# EasyEDA Pro project 16V2_EDA.eprj

# Schematic Schematic2
Board Name: Board1; Create Date: 2024-11-21; Page Name: P1; Project Name: 16V2_EDA; Schematic Name: Schematic2; Update Date: 2024-11-22; Company: 嘉立创EDA; Page Size: A4; Version: V1.0
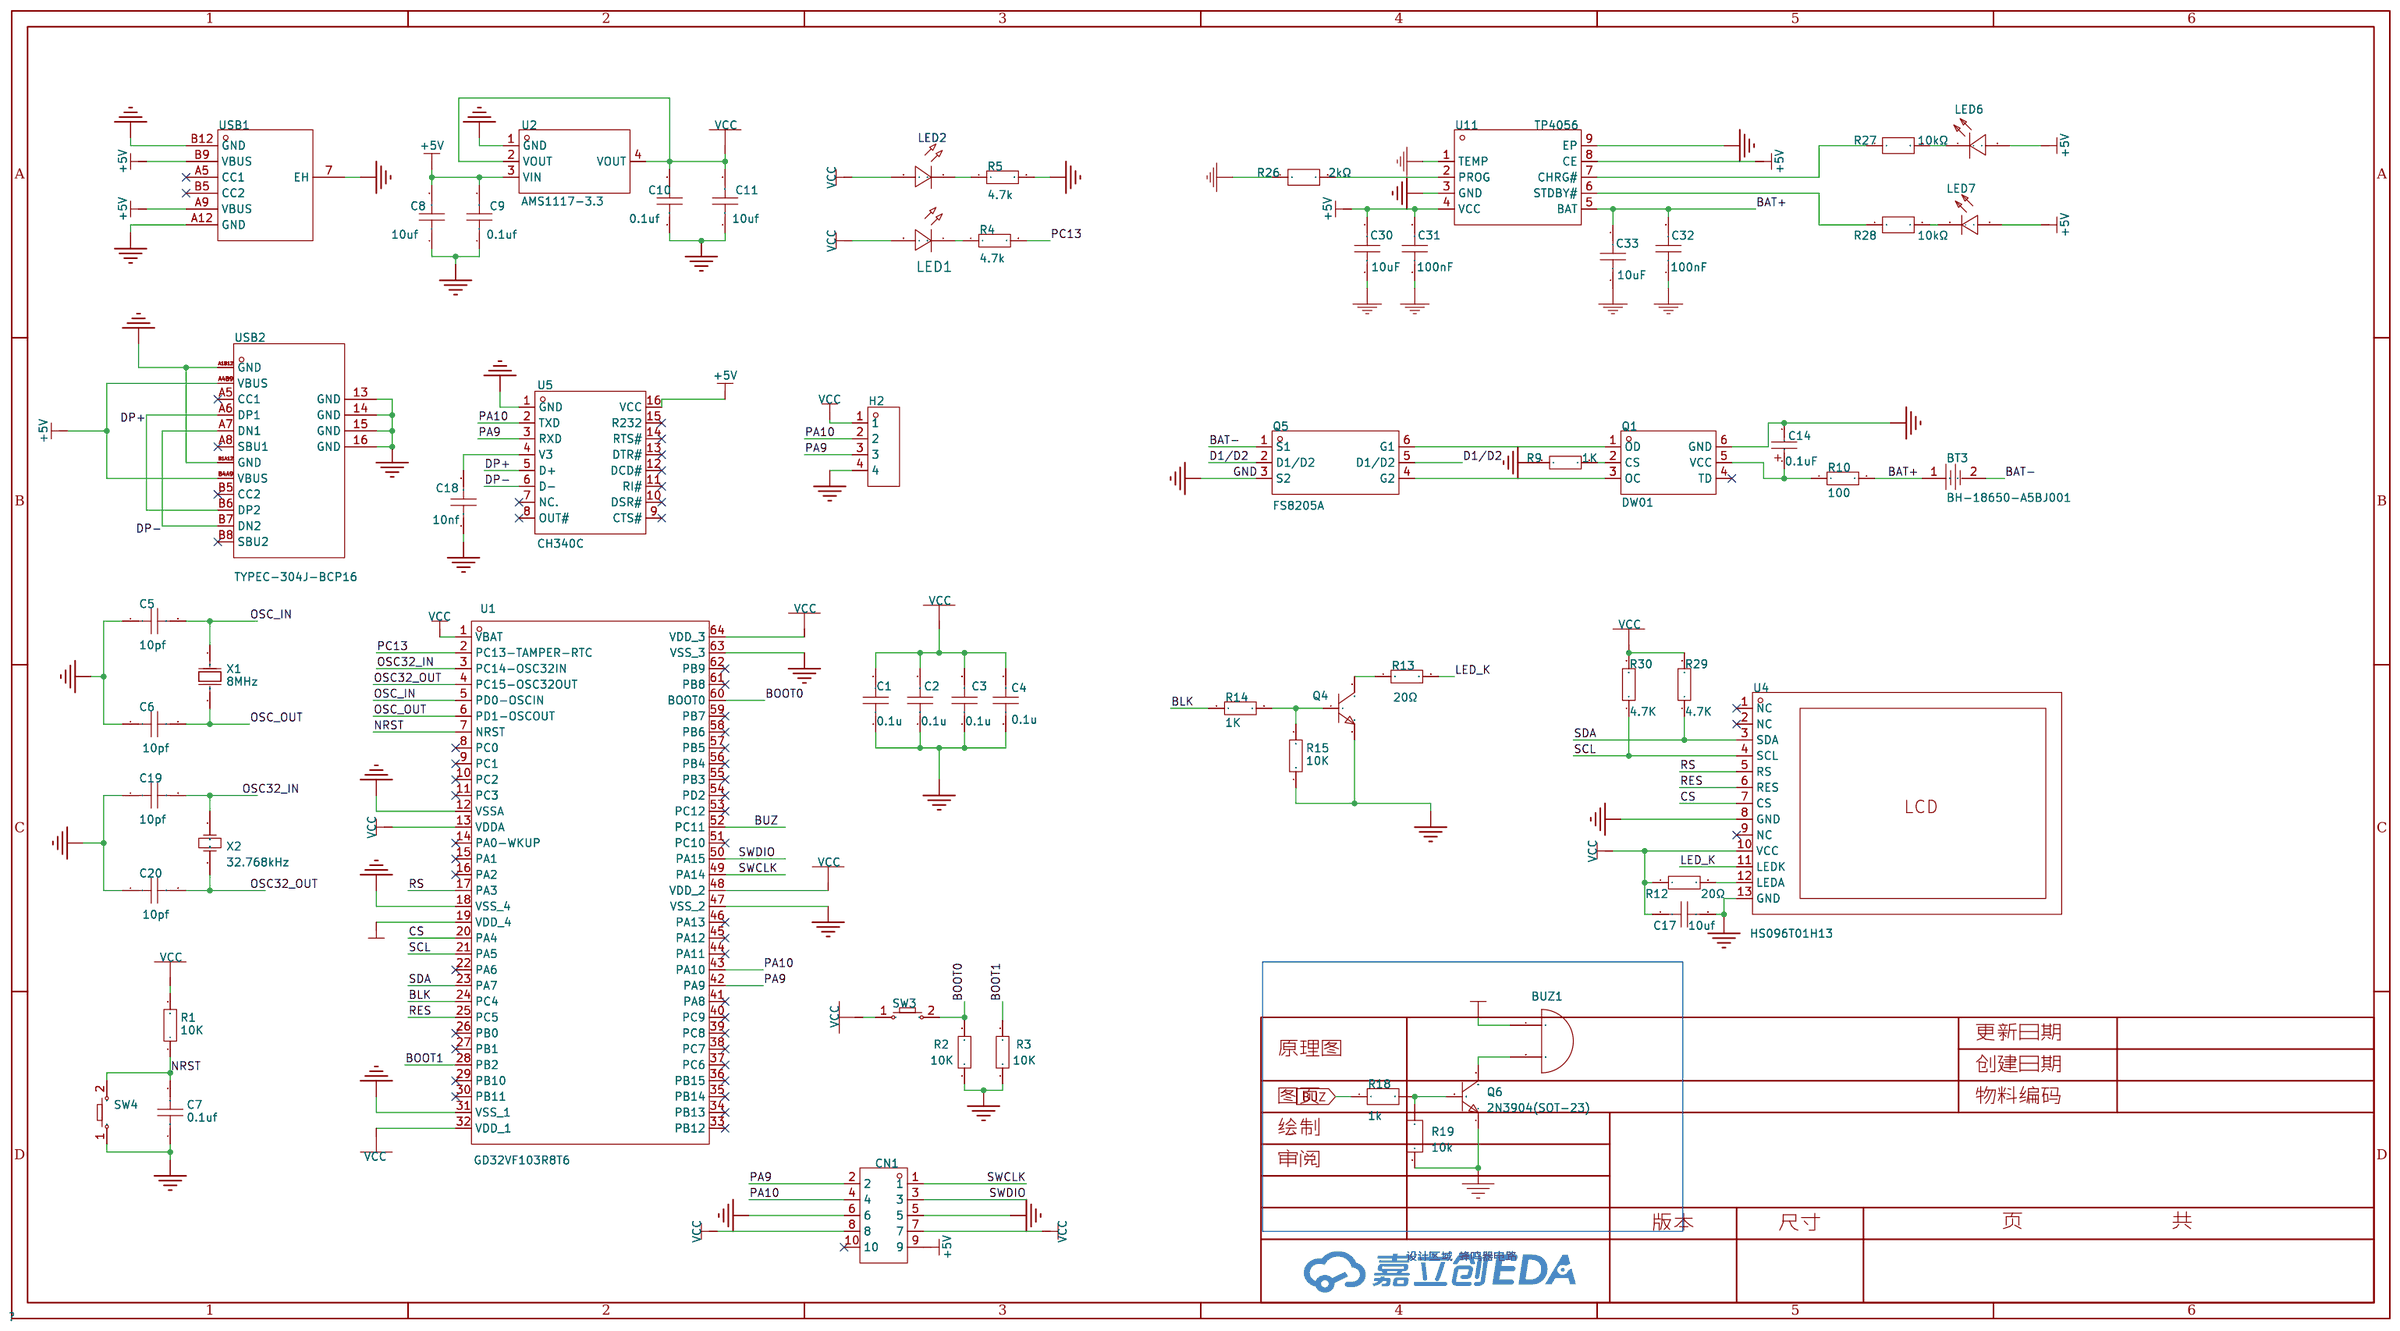
[diagram p0: schematic sheet]

## Parts
BT3  BH-18650-A5BJ001  [BAT-SMD_CR1220-2ZX]
BUZ1  BUZ1  [BUZ]
C1  0.1u  [C0603]
C2  0.1u  [C0603]
C3  0.1u  [C0603]
C4  0.1u  [C0603]
C5  10pf  [C0603]
C6  10pf  [C0603]
C7  0.1uf  [C0603]
C8  10uf  [C0603]
C9  0.1uf  [C0603]
C10  0.1uf  [C0603]
C11  10uf  [C0603]
C14  0.1uF  [C0603]
C17  10uf  [C0603]
C18  10nf  [C0603]
C19  10pf  [C0603]
C20  10pf  [C0603]
C30  10uF  [C0603]
C31  100nF  [C0603]
C32  100nF  [C0603]
C33  10uF  [C0603]
CN1  ZX-PZ2.54-2-5PZZ  [hdr-th_10p-p2.54-v-m-r2-c5-s2.54]
H2  2.54-1*4P反弯排针  [HDR-TH_4P-P2.54-H-M-W10.4]
LED1  -  [LED_0603]
LED2  -  [LED_0603]
LED6  KT-0603R  [LED0603-RD]
LED7  NCD0603B1  [LED0603-RD]
Q1  DW01  [SOT-23-6_L2.9-W1.6-P0.95-LS2.8-BR]
Q4  -  [S8050_SOT-23]
Q5  FS8205A  [SOT-23-6_L2.9-W1.6-P0.95-LS2.8-BR]
Q6  2N3904(SOT-23)  [sot-23-3_l2.9-w1.3-p1.90-ls2.4-br]
R1  10K  [R0603]
R2  10K  [R0603]
R3  10K  [R0603]
R4  4.7k  [R0603]
R5  4.7k  [R0603]
R9  1K  [R0603]
R10  100  [R0603]
R12  20Ω  [R0603]
R13  20Ω  [R0603]
R14  1K  [R0603]
R15  10K  [R0603]
R18  1k  [R0603]
R19  10k  [R0603]
R26  2kΩ  [R0603]
R27  10kΩ  [R0603]
R28  10kΩ  [R0603]
R29  4.7K  [R0603]
R30  4.7K  [R0603]
SW3  -  [Key_SMD_3x4x2]
SW4  -  [Key_SMD_3x4x2]
U1  GD32VF103R8T6  [LQFP-64_L10.0-W10.0-P0.50-LS12.0-BL]
U2  AMS1117-3.3  [SOT-223-3_L6.5-W3.4-P2.30-LS7.0-BR]
U4  HS096T01H13  [LCD-SMD_HS096T01H13]
U5  CH340C  [SOP-16_L10.0-W3.9-P1.27-LS6.0-BL]
U11  TP4056  [esop-8_l4.9-w3.9-p1.27-ls6.0-bl-ep]
USB1  TYPE-C 6P  [TYPE-C-SMD_TYPE-C-6P]
USB2  TYPEC-304J-BCP16  [USB-C-SMD_TYPEC-304J-BCP16]
X1  8MHz  [HC-49S_L10.8-W4.5-P4.88]
X2  32.768kHz  [CRYSTAL-SMD_L3.2-W1.5]

## Library data of the parts
BT3 = BH-18650-A5BJ001: BHNi DIP 适用电池18650电芯//电池底座/卧式DIP 电池盒/电池座 材质：PP  镀镍 ，; Supplier Part: C5383220; Manufacturer: MYOUNG(美阳); Supplier Footprint: 插件; Datasheet: https://atta.szlcsc.com/upload/public/pdf/source/20230321/F45C04DF2D4E00D187312CBE97BD9F67.pdf; Supplier: LCSC
BUZ1 = BUZ1
C1-C11 C17-C20 = CAP_0603: Supplier Footprint: 0603
C14 = C_Ele_SMD_3x5.4mm: Supplier Footprint: SMD,3x5.4mm
C30 C33 = CL21A106KAYNNNE_C15850: 容值:10uF;精度:±10%;额定电压:25V;材质(温度系数):X5R;; LCSC Part Name: 10uF ±10% 25V; Supplier Part: C15850; Manufacturer: SAMSUNG(三星); Manufacturer Part: CL21A106KAYNNNE; Supplier Footprint: 0805; JLCPCB Part Class: Basic Part; Datasheet: https://atta.szlcsc.com/upload/public/pdf/source/20160218/1457707763339.pdf; Supplier: LCSC; Tolerance: ±10%; Voltage Rated: 25V; Temperature Coefficient: X5R
C31 C32 = CC0603KRX7R9BB104: 容值:100nF;精度:±10%;额定电压:50V;材质(温度系数):X7R;; LCSC Part Name: 100nF ±10% 50V; Supplier Part: C14663; Manufacturer: YAGEO(国巨); Supplier Footprint: 0603; JLCPCB Part Class: 基础库; Datasheet: https://atta.szlcsc.com/upload/public/pdf/source/20180910/C282072_33301C7F631E79921B82A8DAC6BCC5B3.pdf; Supplier: LCSC; Tolerance: ±10%; Voltage Rated: 50V; Temperature Coefficient: X7R
CN1 = ZX-PZ2.54-2-5PZZ: 插针结构:2x5P;间距:2.54mm;行距:2.54mm;圆针/方针:方针;安装类型:直插;排数:双排;总PIN位数:10P;额定电流:3A;额定电压:1kV;配合针长度:6mm;塑高:2.5mm;端接针长度:3mm;触头材质:黄铜;触头镀层:金;工作温度范围:-40℃~+105℃;焊接温度(最大值):-;颜色:黑色;; LCSC Part Name: 2x5P 间距:2.54mm 方针 直插; Supplier Part: C7501276; Manufacturer: Megastar(兆星); Supplier Footprint: 插件,P=2.54mm; JLCPCB Part Class: Extended Part; Datasheet: https://atta.szlcsc.com/upload/public/pdf/source/20231122/7DD2FA5A7FDBC10CDDB6051CB6BC6AD1.pdf; Supplier: LCSC; Pin Structure: 2x5P; Pitch: 2.54mm; Row Spacing: 2.54mm; Circluar Pins/Square Pins: 方针; Mounting Type: 直插; Number of Rows: 双排; Number of Pins: 10P; Current Rating (Max): 3A; Voltage Rating (Max): 1kV; Length of Mating Pin: 6mm; Insulation Height: 2.5mm; Length of End Connection Pin: 3mm; Contact Material: 黄铜; Contact Plating: 金; Operating Temperature Range: -40℃~+105℃; Color: 黑色; Check: false
H2 = 2.54-1*4P反弯排针: 插针结构:1x4P;间距:2.54mm;行距:-;圆针/方针:方针;安装类型:弯插;排数:单排;总PIN位数:4P;额定电流:3A;额定电压:-;配合针长度:6mm;塑高:-;端接针长度:-;触头材质:-;触头镀层:-;工作温度范围:-55℃~+105℃;颜色:黑色;; LCSC Part Name: 间距:2.54mm 1x4P 弯插 方针; Supplier Part: C91552; Manufacturer: BOOMELE(博穆精密); Supplier Footprint: 弯插,P=2.54mm; JLCPCB Part Class: 扩展库; Datasheet: https://atta.szlcsc.com/upload/public/pdf/source/20190508/C74252_03DDEC4696EE17172E44B96636392962.pdf; Supplier: LCSC; Pin Structure: 1x4P; Pitch: 2.54mm; Circluar Pins/Square Pins: 方针; Mounting Type: 弯插; Number of Rows: 单排; Number of Pins: 4P; Current Rating (Max): 3A; Length of Mating Pin: 6mm; Operating Temperature Range: -55℃~+105℃; Color: 黑色
LED1 = LED_0603-R: Supplier Footprint: 0603
LED2 = LED_0603-G: Supplier Footprint: 0603
LED6 = KT-0603R: Supplier: LCSC; Manufacturer: KENTO; Supplier Part: C2286; JLCPCB Part Class: Basic Part
LED7 = NCD0603B1: 发光颜色:蓝色;正向电压(VF):2.6V~3.6V;功率:72mW;正向电流:10mA;主波长:463nm~475nm;透镜颜色:无色透明透镜;发光强度:80mcd~220mcd;发光角度:130°;工作温度:-30℃~+85℃;; Supplier Part: C84266; Manufacturer: 国星光电; Supplier Footprint: 0603; JLCPCB Part Class: Extended Part; Datasheet: https://atta.szlcsc.com/upload/public/pdf/source/20200820/C84266_6A3CDBEFA72C6CAD68EDA53474ADAE6C.pdf; Supplier: LCSC; Emitted Color: 蓝色; Forward Voltage (VF): 2.6V~3.6V; Power Dissipation: 72mW; Forward Current: 10mA; Dominant Wavelength: 463nm~475nm; Lens Color: 无色透明透镜; Luminous Intensity: 80mcd~220mcd; Viewing Angle: 130°; Operating Temperature: -30℃~+85℃
Q1 = DW01_C181096: Supplier Part: C181096; Manufacturer: Hottech(合科泰); Supplier Footprint: SOT-23-6; Datasheet: https://atta.szlcsc.com/upload/public/pdf/source/20231007/94AC323C2B651AEA18C7FC8F0156E5A9.pdf; Supplier: LCSC
Q4 = S8050_SOT_NPN: Supplier Footprint: SOT-23
Q5 = FS8205A: 类型:2个N沟道;漏源电压(Vdss):20V;连续漏极电流(Id):6A;功率(Pd):1.5W;导通电阻(RDS(on)@Vgs,Id):19.5mΩ@4.5V,3A;阈值电压(Vgs(th)@Id):700mV@250uA;; LCSC Part Name: 2个N沟道 耐压:20V 电流:6A; Supplier Part: C2830320; Manufacturer: TECH PUBLIC(台舟); Supplier Footprint: SOT-23-6; JLCPCB Part Class: 扩展库; Datasheet: https://atta.szlcsc.com/upload/public/pdf/source/20210810/F53B6D4E8755A1F8E11BAF814CE98E6A.pdf; Supplier: LCSC; Type: 2个N沟道; Drain Source Voltage (Vdss): 20V; Continuous Drain Current (Id): 6A; Power Dissipation (Pd): 1.5W; Drain Source On Resistance (RDS(on)@Vgs,Id): 19.5mΩ@4.5V,3A; Gate Threshold Voltage (Vgs(th)@Id): 700mV@250uA; Total Gate Charge (Qg@Vgs): 5.7nC@10V; Input Capacitance (Ciss@Vds): 466pF@10V; Reverse Transfer Capacitance (Crss@Vds): 58pF@10V; Operating Temperature: -55℃~+150℃@(Tj)
Q6 = 2n3904S-RTK/PS: Supplier: LCSC; Manufacturer: KEC; Supplier Part: C18536; Paste Type: SOT-23
R1-R5 R9 R10 R12-R15 R29 R30 = Res_0603: Supplier Footprint: 0603
R18 = 1k
R19 = 10k
R26 = 0603WAF2001T5E: 电阻类型:厚膜电阻;阻值:2kΩ;精度:±1%;功率:100mW;最大工作电压:75V;温度系数:±100ppm/℃;; LCSC Part Name: 2kΩ ±1% 100mW 厚膜电阻; Supplier Part: C22975; Manufacturer: UNI-ROYAL(厚声); Supplier Footprint: 0603; JLCPCB Part Class: Basic Part; Datasheet: https://atta.szlcsc.com/upload/public/pdf/source/20200306/C422600_1E6D84923E4A46A82E41ADD87F860B5C.pdf; Supplier: LCSC; Type: 厚膜电阻; Tolerance: ±1%; Power(Watts): 100mW; Overload Voltage (Max): 75V; Temperature Coefficient: ±100ppm/℃; Operating Temperature Range: -55℃~+155℃
R27 R28 = 0603WAF1002T5E: 电阻类型:厚膜电阻;阻值:10kΩ;精度:±1%;功率:100mW;最大工作电压:75V;温度系数:±100ppm/℃;; LCSC Part Name: 厚膜电阻 10kΩ ±1% 100mW; Supplier Part: C25804; Manufacturer: UNI-ROYAL(厚声); Supplier Footprint: 0603; JLCPCB Part Class: Basic Part; Datasheet: https://atta.szlcsc.com/upload/public/pdf/source/20200306/C422600_1E6D84923E4A46A82E41ADD87F860B5C.pdf; Supplier: LCSC; Type: 厚膜电阻; Tolerance: ±1%; Power(Watts): 100mW; Overload Voltage (Max): 75V; Temperature Coefficient: ±100ppm/℃; Operating Temperature Range: -55℃~+155℃
SW3 SW4 = Key_SMD_3x4x2: Supplier Footprint: SMD
U1 = GD32VF103R8T6: CPU内核:RISC-V;程序存储容量:64KB;RAM总容量:20KB;GPIO端口数量:51;工作电压范围:-;CPU最大主频:108MHz;程序存储器类型:FLASH;; Supplier Part: C5178402; Manufacturer: GigaDevice(兆易创新); Supplier Footprint: LQFP-64(10x10); Supplier: LCSC; CPU Core: RISC-V; Program Storage Size: 64KB; RAM Size: 20KB; GPIO Ports Number: 51; CPU Maximum Speed: 108MHz; Program Memory Type: FLASH; ADC (Bit): 12bit; DAC (Bit): 12bit; 16Bit Timer: 7; CAN: 2; UART/USART: 5; I2C: 2; I2S: 2; SPI: 3; Universal Serial Bus: 有; Peripheral/Function: 看门狗；RTC实时时钟; Watchdog: 有; Real-Time Clock: 有
U2 = AMS1117-3.3_C6186: 输出类型:固定;最大输入电压:-;输出电压:3.3V;最大输出电流:1A;电源纹波抑制比(PSRR):72dB@(120Hz);输出极性:正极;; LCSC Part Name: 输出3.3V 1A; Supplier Part: C6186; Manufacturer: AMS; Supplier Footprint: SOT-223; JLCPCB Part Class: 基础库; Datasheet: https://atta.szlcsc.com/upload/public/pdf/source/20180727/C6186_7A095716F0823C02F1997A905E26C086.pdf; Supplier: LCSC; Output Type: 固定; Output Voltage: 3.3V; MAX Output Current: 1A; Power Supply Rejection Ratio (PSRR): 72dB@(120Hz); Dropout Voltage: 1.3V@(800mA); Output Polarity: 正极; Number of Outputs: 1
U4 = HS096T01H13: 主控芯片:ST7735;尺寸(inch):0.96;; LCSC Part Name: 0.96寸 0.96寸800x160(RGB)彩色SPI串口TFT液晶显示屏; Supplier Part: C18198246; Manufacturer: HS(汉昇); Datasheet: https://atta.szlcsc.com/upload/public/pdf/source/20230921/67AD52EDFD5E8BFFA1AE424F3A3F761A.pdf; Supplier: LCSC; Main Control Chip: ST7735; Size: 0.96; Operating Temperature: -20℃~+70℃
U5 = CH340C: 应用功能:收发器;接口协议:USB 2.0;数据速率:2Mbps;; LCSC Part Name: CH340C USB转串口芯片 CH340; Supplier Part: C84681; Manufacturer: WCH(南京沁恒); Supplier Footprint: SOP-16; JLCPCB Part Class: 扩展库; Datasheet: https://atta.szlcsc.com/upload/public/pdf/source/20200819/C84681_ADBED554CE321879DBD6B1D06488689C.pdf; Supplier: LCSC; Applications Function: 收发器; Protocol: USB 2.0; Supply Voltage: 3.3V；5V; Data Rate: 2Mbps
U11 = TP4056_C725790: Supplier: LCSC; Supplier Part: C725790; Manufacturer: UMW(友台半导体); JLCPCB Part Class: Extended Part
USB1 = TYPE-C 6P: 连接器类型:Type-C;标准:-;公母:母;端口数量:1;触点数量:6P;安装方式:卧贴;额定电流 - 电源:-;工作温度范围:-40℃~+85℃;; LCSC Part Name: Type-C 母 卧贴; Supplier Part: C456012; Manufacturer: SHOU HAN(首韩); Supplier Footprint: SMD; JLCPCB Part Class: 扩展库; Datasheet: https://atta.szlcsc.com/upload/public/pdf/source/20201203/C456012_B13F72044DF846EDBE9BDD0D1D3CD166.pdf; Supplier: LCSC; Connector Type: Type-C; Gender: 母; Number of Ports: 1; Number of Contacts: 6P; Mounting Style: 卧贴; Operating Temperature Range: -40℃~+85℃
USB2 = TYPEC-304J-BCP16: 连接器类型:Type-C;标准:USB 3.1;公母:母;端口数量:1;触点数量:16P;安装方式:卧贴;额定电流 - 电源:5A;工作温度范围:-40℃~+85℃;焊接温度(最大值):260℃;; LCSC Part Name: Type-C 母 卧贴; Supplier Part: C2835315; Manufacturer: XUNPU(讯普); Supplier Footprint: SMD; Datasheet: https://atta.szlcsc.com/upload/public/pdf/source/20210528/C2835315_A76BD3CF9329D12B6041421AD23BFD66.pdf; Supplier: LCSC; Connector Type: Type-C; Standard: USB 3.1; Gender: 母; Number of Ports: 1; Number of Contacts: 16P; Mounting Style: 卧贴; Current Rating - Power (Max): 5A; Operating Temperature Range: -40℃~+85℃; Soldering Temperature(Max): 260℃
X1 = X49SM8MSD2SC: 晶振类型:贴片晶振;频率:8MHz;常温频差:±20ppm;外接负载电容:20pF;频率稳定度(全温):±30ppm;; LCSC Part Name: 8MHz ±20ppm 20pF; Supplier Part: C12674; Manufacturer: YXC(扬兴晶振); Supplier Footprint: HC-49S-SMD; JLCPCB Part Class: 基础库; Datasheet: https://atta.szlcsc.com/upload/public/pdf/source/20240329/3EBF42EBCAB50CA65B6FA9D7CFA1955A.pdf; Supplier: LCSC; Crystal Type: 贴片晶振; Normal temperature Frequency Tolerance: ±20ppm; External load capacitor: 20pF; Frequency Stability(Full temperature range): ±30ppm; Operating Temperature: -20℃~+70℃
X2 = X308032768KGB2SC: 晶振类型:直插晶振;频率:32.768kHz;常温频差:±10ppm;外接负载电容:12.5pF;频率稳定度(全温):-;; LCSC Part Name: 32.768kHz ±10ppm 12.5pF YT-38; Supplier Part: C52082; Manufacturer: YXC(扬兴晶振); Supplier Footprint: DT-38; JLCPCB Part Class: Extended Part; Datasheet: https://atta.szlcsc.com/upload/public/pdf/source/20240329/231E1A1EB7C875CD193DBE6664A3DE3A.pdf; Supplier: LCSC; Crystal Type: 直插晶振; Normal temperature Frequency Tolerance: ±10ppm; External load capacitor: 12.5pF; Operating Temperature: -20℃~+70℃

## Nets
+5V: C8.2 C9.2 C30.2 C31.2 CN1.9 LED6.2(A) LED7.2(+) U2.3(VIN) U5.16(VCC) U11.4(VCC) U11.8(CE) USB1.A9(VBUS) USB1.B9(VBUS) USB2.A4B9(VBUS) USB2.B4A9(VBUS)
GND: C1.1 C2.1 C3.1 C4.1 C5.1 C6.1 C7.1 C8.1 C9.1 C10.1 C11.1 C14.2 C17.2 C18.1 C19.1 C20.1 C30.1 C31.1 C32.1 C33.1 CN1.5 CN1.6 H2.4 Q1.6(GND) Q4.2 Q5.3(S2) Q6.1(E) R2.1 R3.1 R5.2 R9.1 R15.1 R19.1 R26.1 SW4.1 U1.12(VSSA) U1.18(VSS_4) U1.31(VSS_1) U1.47(VSS_2) U1.63(VSS_3) U2.1(GND) U4.8(GND) U4.13(GND) U5.1(GND) U11.1(TEMP) U11.3(GND) U11.9(EP) USB1.7(EH) USB1.A12(GND) USB1.B12(GND) USB2.13(GND) USB2.14(GND) USB2.15(GND) USB2.16(GND) USB2.A1B12(GND) USB2.B1A12(GND)
VCC: BUZ1.1(A) C1.2 C2.2 C3.2 C4.2 C10.2 C11.2 C17.1 CN1.7 CN1.8 H2.1 LED1.2(A) LED2.2(A) R1.2 R12.1 R29.2 R30.2 SW3.1 U1.1(VBAT) U1.13(VDDA) U1.19(VDD_4) U1.32(VDD_1) U1.48(VDD_2) U1.64(VDD_3) U2.2(VOUT) U2.4(VOUT) U4.10(VCC)
BAT+: BT3.1 C32.2 C33.2 R10.2 U11.5(BAT)
BAT-: BT3.2 Q5.1(S1)
BLK: R14.1 U1.24(PC4)
BOOT0: R2.2 SW3.2 U1.60(BOOT0)
BOOT1: R3.2 U1.28(PB2)
BUZ: R18.1 U1.52(PC11)
CS: U1.20(PA4) U4.7(CS)
D1/D2: Q5.2(D1/D2) Q5.5(D1/D2)
DP+: U5.5(D+) USB2.A6(DP1) USB2.B6(DP2)
DP-: U5.6(D-) USB2.A7(DN1) USB2.B7(DN2)
LED_K: R13.2 U4.11(LEDK)
NRST: C7.2 R1.1 SW4.2 U1.7(NRST)
OSC32_IN: C19.2 U1.3(PC14-OSC32IN) X2.1(OSC1)
OSC32_OUT: C20.2 U1.4(PC15-OSC32OUT) X2.2(OSC2)
OSC_IN: C5.2 U1.5(PD0-OSCIN) X1.1(OSC1)
OSC_OUT: C6.2 U1.6(PD1-OSCOUT) X1.2(OSC2)
PA9: CN1.2 H2.3 U1.42(PA9) U5.3(RXD)
PA10: CN1.4 H2.2 U1.43(PA10) U5.2(TXD)
PC13: R4.2 U1.2(PC13-TAMPER-RTC)
RES: U1.25(PC5) U4.6(RES)
RS: U1.17(PA3) U4.5(RS)
SCL: R30.1 U1.21(PA5) U4.4(SCL)
SDA: R29.1 U1.23(PA7) U4.3(SDA)
SWCLK: CN1.1 U1.49(PA14)
SWDIO: CN1.3 U1.50(PA15)
$1N3244: LED1.1(C) R4.1
$1N3260: LED2.1(C) R5.1
$1N3280: Q1.2(CS) R9.2
$1N3281: C14.1 Q1.5(VCC) R10.1
$1N3299: R12.2 U4.12(LEDA)
$1N3320: Q4.3 R13.1
$1N3321: Q4.1 R14.2 R15.2
$1N3342: C18.2 U5.4(V3)
$1N3364: R26.2 U11.2(PROG)
$1N3367: R27.1 U11.7(CHRG#)
$1N3368: LED6.1(K) R27.2
$1N3369: LED7.1(-) R28.2
$1N3370: R28.1 U11.6(STDBY#)
$1N3387: Q1.1(OD) Q5.6(G1)
$1N3388: Q1.3(OC) Q5.4(G2)
$1N22505: Q6.2(B) R18.2 R19.2
$1N22563: BUZ1.2(B) Q6.3(C)

Not connected (* = marked no-connect by the designer): CN1 10*; Q1 4(TD)*; U1 8(PC0)* 9(PC1)* 10(PC2)* 11(PC3)* 14(PA0-WKUP)* 15(PA1)* 16(PA2)* 22(PA6)* 26(PB0)* 27(PB1)* 29(PB10)* 30(PB11)* 33(PB12)* 34(PB13)* 35(PB14)* 36(PB15)* 37(PC6)* 38(PC7)* 39(PC8)* 40(PC9)* 41(PA8)* 44(PA11)* 45(PA12)* 46(PA13)* 51(PC10)* 53(PC12)* 54(PD2)* 55(PB3)* 56(PB4)* 57(PB5)* 58(PB6)* 59(PB7)* 61(PB8)* 62(PB9)*; U4 1(NC)* 2(NC)* 9(NC)*; U5 7(NC.)* 8(OUT#)* 9(CTS#)* 10(DSR#)* 11(RI#)* 12(DCD#)* 13(DTR#)* 14(RTS#)* 15(R232)*; USB1 A5(CC1)* B5(CC2)*; USB2 A5(CC1)* A8(SBU1)* B5(CC2)* B8(SBU2)*

## Notes on the sheet
- 设计区域 蜂鸣器电路

# Board PCB
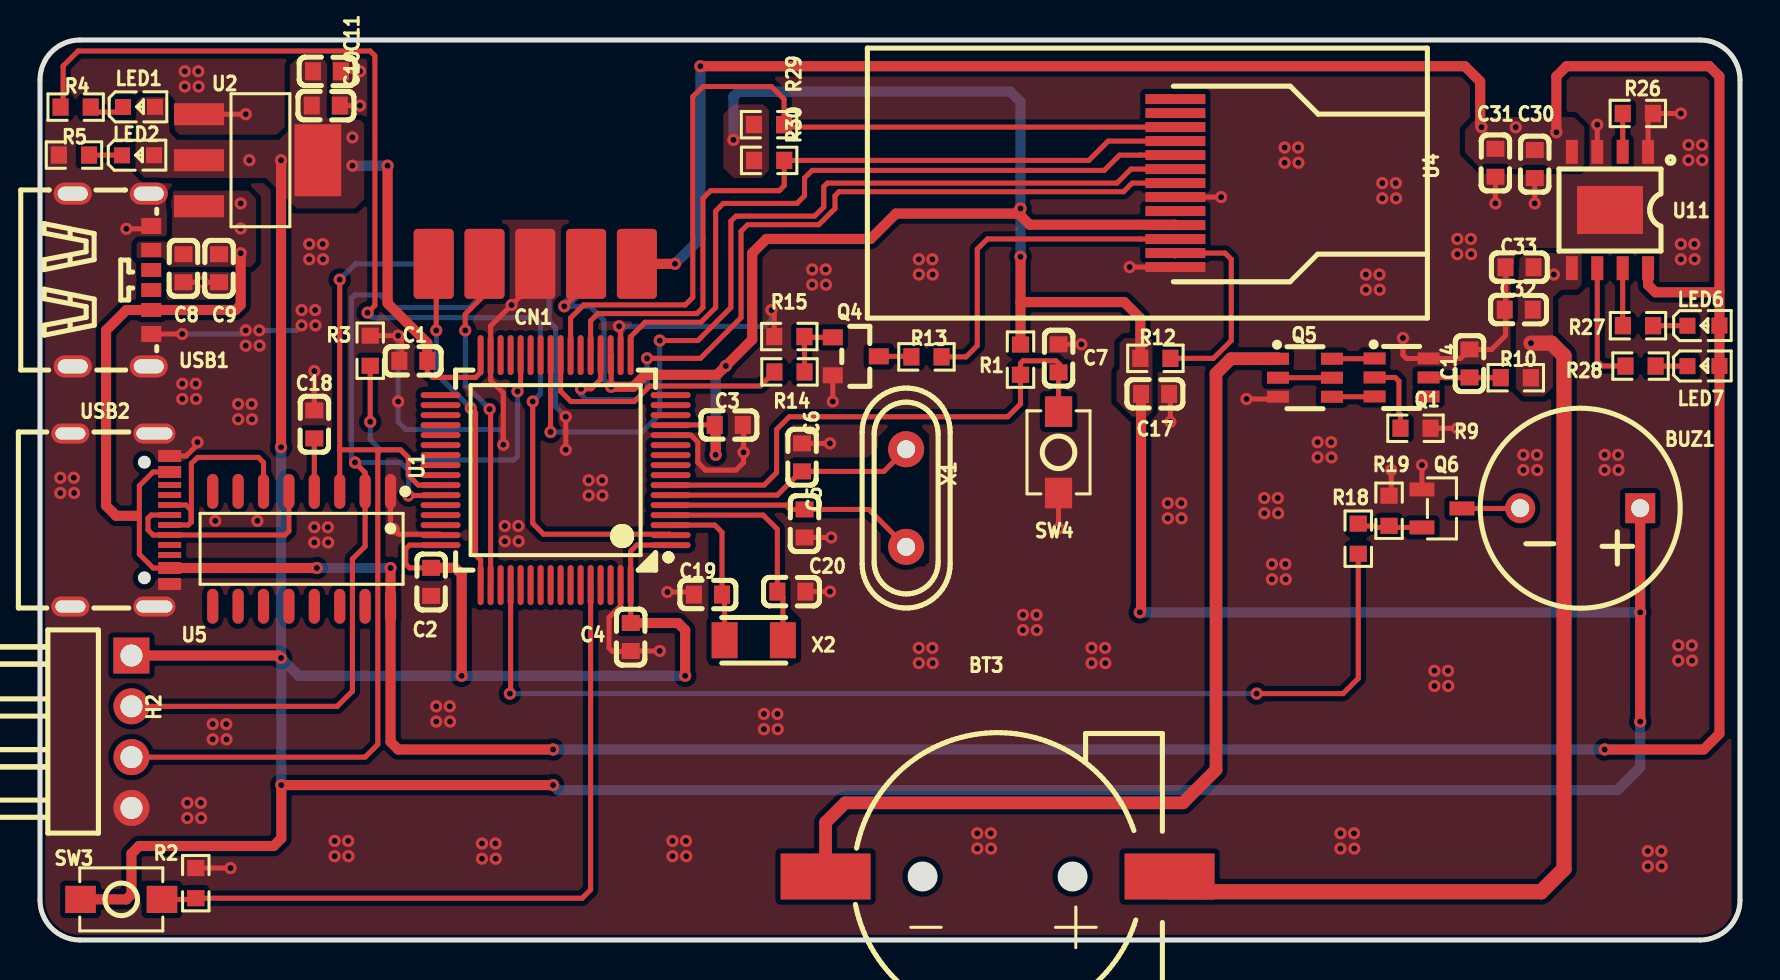
[diagram p1: board, top side]
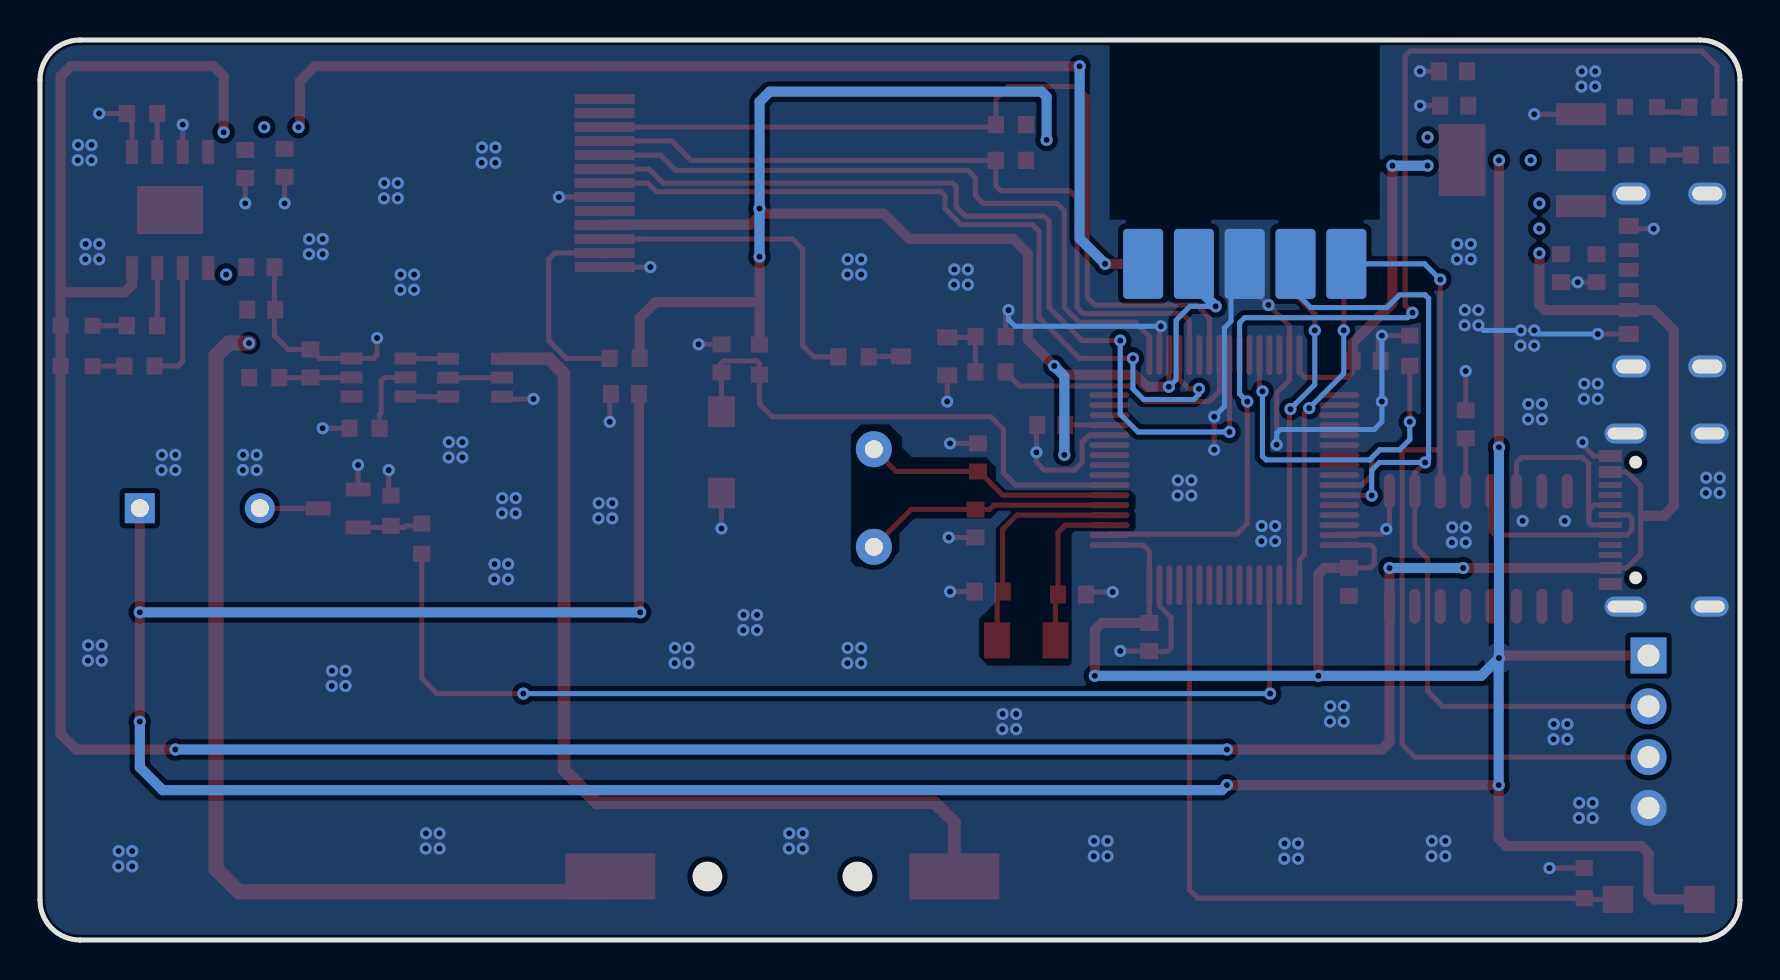
[diagram p2: board, bottom side, seen from below]

Outline 85 x 45 mm; copper layers: Top Layer, Inner1, Inner2, Inner3, Inner4, Inner5, Inner6, Inner7, Inner8, Inner9, Inner10, Inner11, Inner12, Inner13, Inner14, Inner15, Inner16, Inner17, Inner18, Inner19, Inner20, Inner21, Inner22, Inner23, Inner24, Inner25, Inner26, Inner27, Inner28, Inner29, Inner30, Bottom Layer. Coordinates in mm from the lower left corner of the outline.
Outline path: 0,43 0,2 arc(0.59,0.59) 2,0 83,0 arc(84.41,0.59) 85,2 85,43 arc(84.41,44.41) 83,45 2,45 arc(0.59,44.41) 0,43
Stack: Top Layer 0.035mm / Dielectric1 1.51mm FR4 er 4.5 / Bottom Layer 0.035mm

## Design rules (mm)
net DP+: DP1
net DP-: DP1
template: 自定义配置
spacing copperThickness1oz (default): track to track 0.178, other pairs 0.152 to 0.203
spacing copperThickness2oz: track to track 0.203, other pairs 0.152 to 0.3
track width copperThickness1oz (default): min 0.254, default 0.254, max 2.54
track width copperThickness2oz: min 0.203, default 0.254, max 2.54
differential pair differentialPair (default): width min 0.127, default 0.254, max 2.54; gap min 0.152, default 0.152
via viaSize (default): diameter min 0.61, default 0.61, max 0.61; hole min 0.305, default 0.305, max 0.305

## Placement (name value [footprint] x y rotation side)
BT3  BH-18650-A5BJ001  [BAT-SMD_CR1220-2ZX]  47.88 3.17 180 top
BUZ1  BUZ1  [BUZ]  80.01 21.59 180 top
C1  0.1u  [C0603]  18.67 28.96 0 top
C2  0.1u  [C0603]  19.56 17.91 90 top
C3  0.1u  [C0603]  34.44 25.75 180 top
C4  0.1u  [C0603]  29.54 15.15 90 top
C5  10pf  [C0603]  38.23 20.83 90 top
C6  10pf  [C0603]  38.1 24.13 270 top
C7  0.1uf  [C0603]  50.93 29.08 270 top
C8  10uf  [C0603]  7.17 33.59 90 top
C9  0.1uf  [C0603]  8.95 33.59 90 top
C10  0.1uf  [C0603]  14.29 41.72 180 top
C11  10uf  [C0603]  14.35 43.43 180 top
C14  0.1uF  [C0603]  71.48 28.83 90 top
C17  10uf  [C0603]  55.75 27.31 0 top
C18  10nf  [C0603]  13.72 25.78 270 top
C19  10pf  [C0603]  33.4 17.27 0 top
C20  10pf  [C0603]  37.57 17.42 180 top
C30  10uF  [C0603]  74.74 38.8 90 top
C31  100nF  [C0603]  72.77 38.86 90 top
C32  100nF  [C0603]  73.94 31.52 0 top
C33  10uF  [C0603]  73.98 33.64 0 top
CN1  ZX-PZ2.54-2-5PZZ  [hdr-th_10p-p2.54-v-m-r2-c5-s2.54]  24.76 40.64 180 top
H2  2.54-1*4P反弯排针  [HDR-TH_4P-P2.54-H-M-W10.4]  4.57 10.41 270 top
LED1  -  [LED_0603]  5 41.66 0 top
LED2  -  [LED_0603]  4.95 39.24 0 top
LED6  KT-0603R  [LED0603-RD]  83.17 30.72 0 top
LED7  NCD0603B1  [LED0603-RD]  83.17 28.7 0 top
Q1  DW01  [SOT-23-6_L2.9-W1.6-P0.95-LS2.8-BR]  68.08 28.13 180 top
Q4  -  [S8050_SOT-23]  40.79 29.31 180 top
Q5  FS8205A  [SOT-23-6_L2.9-W1.6-P0.95-LS2.8-BR]  63.25 28.11 180 top
Q6  2N3904(SOT-23)  [sot-23-3_l2.9-w1.3-p1.90-ls2.4-br]  70.1 21.58 180 top
R1  10K  [R0603]  49.03 29.02 90 top
R2  10K  [R0603]  7.79 2.84 270 top
R3  10K  [R0603]  16.51 29.46 270 top
R4  4.7k  [R0603]  1.78 41.64 180 top
R5  4.7k  [R0603]  1.7 39.25 180 top
R9  1K  [R0603]  68.78 25.59 180 top
R10  100  [R0603]  73.79 28.11 0 top
R12  20Ω  [R0603]  55.77 29.08 0 top
R13  20Ω  [R0603]  44.32 29.16 0 top
R14  1K  [R0603]  37.47 28.4 0 top
R15  10K  [R0603]  37.47 30.17 0 top
R18  1k  [R0603]  65.91 20.07 90 top
R19  10k  [R0603]  67.45 21.46 270 top
R26  2kΩ  [R0603]  79.89 41.33 180 top
R27  10kΩ  [R0603]  79.9 30.72 0 top
R28  10kΩ  [R0603]  80.03 28.7 0 top
R29  4.7K  [R0603]  36.45 40.77 180 top
R30  4.7K  [R0603]  36.46 38.98 180 top
SW3  -  [Key_SMD_3x4x2]  4.06 2.03 0 top
SW4  -  [Key_SMD_3x4x2]  50.93 24.38 90 top
U1  GD32VF103R8T6  [LQFP-64_L10.0-W10.0-P0.50-LS12.0-BL]  25.78 23.5 90 top
U2  AMS1117-3.3  [SOT-223-3_L6.5-W3.4-P2.30-LS7.0-BR]  10.92 38.99 180 top
U4  HS096T01H13  [LCD-SMD_HS096T01H13]  56.77 37.85 0 top
U5  CH340C  [SOP-16_L10.0-W3.9-P1.27-LS6.0-BL]  13.08 19.56 180 top
U11  TP4056  [esop-8_l4.9-w3.9-p1.27-ls6.0-bl-ep]  78.5 36.5 180 top
USB1  TYPE-C 6P  [TYPE-C-SMD_TYPE-C-6P]  3.6 33 270 top
USB2  TYPEC-304J-BCP16  [USB-C-SMD_TYPEC-304J-BCP16]  4 21 270 top
X1  8MHz  [HC-49S_L10.8-W4.5-P4.88]  43.31 22.1 90 top
X2  32.768kHz  [CRYSTAL-SMD_L3.2-W1.5]  35.69 14.99 0 top

## Footprints (pads in the part's own frame, mm; a bottom-side part is the same pattern mirrored in y, then rotated)
BAT-SMD_CR1220-2ZX
  rect 4.5x2.3 smd: 1(-8.6,0) 2(8.6,0)
BUZ
  rect 1.5x1.5 hole 0.9: 1(0,0)
  round 1.5 hole 0.9: 2(6,0)
C0603
  rect 0.8x0.9 smd: 1(-0.7,0) 2(0.7,0)
CRYSTAL-SMD_L3.2-W1.5
  rect 1.3x1.8 smd: 1(-1.458,0) 2(1.458,0)
esop-8_l4.9-w3.9-p1.27-ls6.0-bl-ep
  rect 0.6x1.2 smd: 1(-1.905,-2.909) 2(-0.635,-2.909) 3(0.635,-2.909) 4(1.905,-2.909) 5(1.905,2.909) 6(0.635,2.909) 7(-0.635,2.909) 8(-1.905,2.909)
  rect 3.3x2.4 smd: 9(0,0)
HC-49S_L10.8-W4.5-P4.88
  round 1.8 hole 0.9: 1(-2.44,0) 2(2.44,0)
HDR-TH_4P-P2.54-H-M-W10.4
  rect 1.8x1.8 hole 1.1: 1(-3.81,0)
  round 1.8 hole 1.1: 2(-1.27,0) 3(1.27,0) 4(3.81,0)
hdr-th_10p-p2.54-v-m-r2-c5-s2.54
  rrect 2x3.5 smd: 1(5.08,6.832) 3(2.54,6.832) 5(0,6.832) 7(-2.54,6.832) 9(-5.08,6.832)
  rrect 2x3.5 smd far side: 2(5.08,6.832) 4(2.54,6.832) 6(0,6.832) 8(-2.54,6.832) 10(-5.08,6.832)
Key_SMD_3x4x2
  rect 1.53x1.36 smd: 1(-2.035,0) 2(2.035,0)
LCD-SMD_HS096T01H13
  rect 3x0.5 smd: 1(0,4.2) 2(0,3.5) 3(0,2.8) 4(0,2.1) 5(0,1.4) 6(0,0.7) 7(0,0) 8(0,-0.7) 9(0,-1.4) 10(0,-2.1) 11(0,-2.8) 12(0,-3.5) 13(0,-4.2)
LED0603-RD
  rect 0.8x0.8 smd: 1(-0.799,-0.004) 2(0.799,0.004)
LED_0603
  rect 0.8x0.8 smd: 1(-0.851,-0.01) 2(0.75,-0.005)
LQFP-64_L10.0-W10.0-P0.50-LS12.0-BL
  oval 0.3x2 smd: 1(-3.75,-5.75) 2(-3.25,-5.75) 3(-2.75,-5.75) 4(-2.25,-5.75) 5(-1.75,-5.75) 6(-1.25,-5.75) 7(-0.75,-5.75) 8(-0.25,-5.75) 9(0.25,-5.75) 10(0.75,-5.75) 11(1.25,-5.75) 12(1.75,-5.75) 13(2.25,-5.75) 14(2.75,-5.75) 15(3.25,-5.75) 16(3.75,-5.75) 33(3.75,5.75) 34(3.25,5.75) 35(2.75,5.75) 36(2.25,5.75) 37(1.75,5.75) 38(1.25,5.75) 39(0.75,5.75) 40(0.25,5.75) 41(-0.25,5.75) 42(-0.75,5.75) 43(-1.25,5.75) 44(-1.75,5.75) 45(-2.25,5.75) 46(-2.75,5.75) 47(-3.25,5.75) 48(-3.75,5.75)
  oval 2x0.3 smd: 17(5.75,-3.75) 18(5.75,-3.25) 19(5.75,-2.75) 20(5.75,-2.25) 21(5.75,-1.75) 22(5.75,-1.25) 23(5.75,-0.75) 24(5.75,-0.25) 25(5.75,0.25) 26(5.75,0.75) 27(5.75,1.25) 28(5.75,1.75) 29(5.75,2.25) 30(5.75,2.75) 31(5.75,3.25) 32(5.75,3.75) 49(-5.75,3.75) 50(-5.75,3.25) 51(-5.75,2.75) 52(-5.75,2.25) 53(-5.75,1.75) 54(-5.75,1.25) 55(-5.75,0.75) 56(-5.75,0.25) 57(-5.75,-0.25) 58(-5.75,-0.75) 59(-5.75,-1.25) 60(-5.75,-1.75) 61(-5.75,-2.25) 62(-5.75,-2.75) 63(-5.75,-3.25) 64(-5.75,-3.75)
R0603
  rect 0.806x0.864 smd: 1(-0.753,0) 2(0.753,0)
S8050_SOT-23
  rect 1x0.8 smd: 1(1.15,-0.823) 2(1.15,1.077) 3(-1.15,0.127)
SOP-16_L10.0-W3.9-P1.27-LS6.0-BL
  oval 0.56x1.745 smd: 1(-4.445,-2.873) 2(-3.175,-2.873) 3(-1.905,-2.873) 4(-0.635,-2.873) 5(0.635,-2.873) 6(1.905,-2.873) 7(3.175,-2.873) 8(4.445,-2.873) 9(4.445,2.873) 10(3.175,2.873) 11(1.905,2.873) 12(0.635,2.873) 13(-0.635,2.873) 14(-1.905,2.873) 15(-3.175,2.873) 16(-4.445,2.873)
sot-23-3_l2.9-w1.3-p1.90-ls2.4-br
  rect 1.25x0.7 smd: 1(1,-0.95) 2(1,0.95) 3(-1,0)
SOT-23-6_L2.9-W1.6-P0.95-LS2.8-BR
  rect 1.1x0.6 smd: 1(1.35,-0.95) 2(1.35,0) 3(1.35,0.95) 4(-1.35,0.95) 5(-1.35,0) 6(-1.35,-0.95)
SOT-223-3_L6.5-W3.4-P2.30-LS7.0-BR
  rect 2.5x1.1 smd: 1(2.97,-2.3) 2(2.97,0) 3(2.97,2.3)
  rect 2.34x3.6 smd: 4(-2.97,0)
TYPE-C-SMD_TYPE-C-6P
  oval 1.1x1.9 hole 0.7x1.5: 7(-4.32,1.837) 7(-4.32,-1.962) 7(4.32,1.837) 7(4.32,-1.962)
  rect 0.7x1 smd: A5(-0.5,1.962) A9(1.5,1.962) B5(0.5,1.962) B9(-1.5,1.962)
  rect 0.8x1 smd: A12(2.7,1.962) B12(-2.7,1.962)
USB-C-SMD_TYPEC-304J-BCP16
  oval 1x2.1 hole 0.6x1.8: 13(-4.325,1.718) 14(4.325,1.718)
  oval 1x1.9 hole 0.6x1.5: 15(-4.325,-2.482) 16(4.325,-2.482)
  rect 0.6x1.15 smd: A1B12(-3.2,2.482) A4B9(-2.4,2.482) B1A12(3.2,2.482) B4A9(2.4,2.482)
  rect 0.3x1.15 smd: A5(-1.25,2.482) A6(-0.25,2.482) A7(0.25,2.482) A8(1.25,2.482) B5(1.75,2.482) B6(0.75,2.482) B7(-0.75,2.482) B8(-1.75,2.482)

## Nets
As in the schematic.

Pads without a net: CN1 10; Q1 4; U1 8 9 10 11 14 15 16 22 26 27 29 30 33 34 35 36 37 38 39 40 41 44 45 46 51 53 54 55 56 57 58 59 61 62; U4 1 2 9; U5 7 8 9 10 11 12 13 14 15; USB1 A5 B5; USB2 A5 A8 B5 B8

## Via types
v1: diameter 0.61, hole 0.305, Top Layer to Bottom Layer, 249 vias

## Routing (per net, layer and track width the routed paths; a pad name or vN(x,y) marks a point on that pad's centre or on a via; arc(x,y) is an arc through that point)
+5V: length 216.8
  Top Layer w0.254: USB2.B4A9 5.66,18.6 4.97,19.29 4.97,22.71 5.66,23.4 USB2.A4B9
  Top Layer w0.508: v1(25.65,9.53) 17.91,9.53 17.53,9.91 U5.16 v1(17.53,18.6) ; v1(10.03,34.34) 10.03,31.75 9.78,31.5 USB1.A9 4.32,31.5 3.3,30.48 3.3,21.72 3.81,21.21 4.83,21.21 ; 83.97,32.44 LED6.2 LED7.2 83.97,10.31 83.19,9.53 v1(78.23,9.53) ; 83.97,32.44 83.91,32.39 80.77,32.39 80.4,32.75 U11.8 ; 83.97,32.44 83.97,43.18 83.46,43.69 76.33,43.69 75.82,43.18 v1(75.82,40.39) ; CN1.9 v1(31.75,33.81) ; USB2.B4A9 v1(13.84,18.6) ; v1(72.08,40.64) 72.01,40.71 72.01,42.93 71.25,43.69 v1(33.02,43.69)
  Bottom Layer w0.508: v1(31.75,33.81) 33.02,35.08 v1(33.02,43.69) ; v1(13.84,18.6) v1(17.53,18.6) ; v1(25.65,9.53) v1(78.23,9.53)
  vias: v1(10.03,36.83) v1(10.03,35.57) v1(73.79,40.64)
GND: length 120.2
  Top Layer w0.254: U1.12 32.54,25.25 32.89,24.89 32.89,23.88 33.27,23.5 34.8,23.5 35.18,23.88 v1(35.18,24.38) 35.18,25.71 C3.1 ; v1(36.58,31.5) 36.71,31.36 R15.1 ; v1(4.32,35.56) 5.42,35.56 USB1.B12 ; R3.1 v1(17.91,30.22) 18.09,30.04 18.09,29.07 17.97,28.96 ; U1.47 19.99,20.29 17.94,20.29 17.53,20.7 U5.1 ; C20.1 v1(39.5,17.42) ; C31.1 v1(72.77,36.83) ; U4.13 v1(54.48,33.65) ; 13.72,26.48 v1(13.72,28.45) ; U1.63 29.03,16.71 28.45,16.13 28.45,14.61 28.63,14.43 29.51,14.43 C4.1 v1(30.99,14.45) ; U11.3 v1(77.86,40.77) ; v1(68.15,30.1) 68.15,29.26 68.33,29.08 Q1.6 71.03,29.08 C14.2 72.58,29.53 73.28,30.23 73.28,32.93 73.28,32.94 C33.1 ; Q4.2 v1(39.64,26.92) ; Q6.1 v1(69.1,23.75) ; USB2.A1B12 7.31,24.2 7.87,24.77 v1(7.87,24.89) ; C11.1 v1(16,43.43) ; v1(26.29,26.16) v1(26.29,24.51) ; v1(31.37,17.4) 32.57,17.4 32.7,17.27 ; R9.1 v1(70.87,25.59) ; C5.1 v1(39.56,20.13) 39.62,20.07 ; C30.1 v1(74.74,36.83) ; C8.1 v1(8.11,32.89) C9.1 ; v1(82.04,41.33) 80.65,41.33 80.4,41.08 U11.1 ; v1(67.56,23.5) 67.56,22.33 R19.1 ; USB1.A12 v1(7.11,30.3) ; v1(16,41.72) C10.1 ; SW4.1 v1(50.93,20.57) ; C6.1 v1(39.5,24.83) ; U1.18 29.03,30.61 v1(28.96,30.69) ; C7.1 v1(52.07,29.78) ; v1(60.32,27.05) 61.78,27.05 Q5.3 ; v1(23.17,24.77) 23.17,27.36 22.53,27.99 U1.31 22.53,30.7 v1(23.58,31.75) 24.76,32.94 CN1.5 ; v1(56.51,25.91) 56.51,27.24 C17.2 ; R2.1 v1(9.53,3.6) ; U2.1 v1(10.29,41.29) ; U4.8 v1(59.06,37.15)
  Bottom Layer w0.254: v1(17.91,30.22) v1(17.91,26.92) 17.91,25.91 18.29,25.53 22.99,25.53 23.17,25.35 v1(23.17,24.77) ; v1(36.58,31.5) 36.58,31.02 36.24,30.69 v1(28.96,30.69) ; CN1.5 25.45,33.12 25.45,30.94 25.78,30.61 25.78,26.67 v1(26.29,26.16) ; v1(13.08,30.73) 12.83,30.48 v1(10.96,30.48) ; v1(10.29,30.48) 10.11,30.3 v1(7.11,30.3)
  vias: v1(1.02,23.11) v1(1.02,22.35) v1(1.69,23.11) v1(1.71,22.35) v1(7.11,27.81) v1(7.11,27.05) v1(7.24,43.43) v1(7.24,42.67) v1(7.37,6.86) v1(7.37,6.1) v1(7.79,27.81) v1(7.8,27.05) v1(7.91,43.43) v1(7.93,42.67) v1(8.04,6.86) v1(8.06,6.1) v1(8.64,10.8) v1(8.64,10.03) v1(8.76,20.95) v1(9.31,10.8) v1(9.33,10.03) v1(9.91,26.8) v1(9.91,26.03) v1(10.29,29.72) v1(10.58,26.8) v1(10.6,26.03) v1(10.87,20.95) v1(10.98,29.72) v1(13.08,31.5) v1(13.46,34.8) v1(13.46,34.04) v1(13.72,20.64) v1(13.72,19.88) v1(13.76,31.5) v1(13.77,30.73) v1(14.14,34.8) v1(14.15,34.04) v1(14.39,20.64) v1(14.41,19.88) v1(14.73,4.95) v1(14.73,4.19) v1(15.41,4.95) v1(15.42,4.19) v1(17.68,20.54) v1(19.81,11.68) v1(19.81,10.92) v1(20.49,11.68) v1(20.5,10.92) v1(22.1,4.83) v1(22.1,4.06) v1(22.77,4.83) v1(22.79,4.06) v1(23.24,20.7) v1(23.24,19.94) v1(23.92,20.7) v1(23.93,19.94) v1(27.43,22.99) v1(27.43,22.22) v1(28.11,22.99) v1(28.12,22.22) v1(31.62,4.95) v1(31.62,4.19) v1(32.3,4.95) v1(32.31,4.19) v1(36.19,11.3) v1(36.19,10.54) v1(36.87,11.3) v1(36.88,10.54) v1(38.61,33.53) v1(38.61,32.77) v1(39.28,33.53) v1(39.3,32.77) v1(43.94,34.04) v1(43.94,33.27) v1(43.94,14.61) v1(43.94,13.84) v1(44.62,34.04) v1(44.63,33.27) v1(44.62,14.61) v1(44.63,13.84) v1(46.86,5.33) v1(46.86,4.57) v1(47.54,5.33) v1(47.55,4.57) v1(49.15,16.26) v1(49.15,15.49) v1(49.82,16.26) v1(49.84,15.49) v1(52.58,14.61) v1(52.58,13.84) v1(53.25,14.61) v1(53.27,13.84) v1(56.39,21.84) v1(56.39,21.08) v1(57.06,21.84) v1(57.08,21.08) v1(61.21,22.1) v1(61.21,21.34) v1(61.59,18.8) v1(61.59,18.03) v1(61.89,22.1) v1(61.9,21.34) v1(62.23,39.62) v1(62.23,38.86) v1(62.27,18.8) v1(62.28,18.03) v1(62.91,39.62) v1(62.92,38.86) v1(63.88,24.89) v1(63.88,24.13) v1(64.56,24.89) v1(64.57,24.13) v1(65.02,5.33) v1(65.02,4.57) v1(65.7,5.33) v1(65.71,4.57) v1(66.29,33.27) v1(66.29,32.51) v1(66.97,33.27) v1(66.98,32.51) v1(67.11,37.85) v1(67.11,37.08) v1(67.79,37.85) v1(67.8,37.08) v1(69.72,13.46) v1(69.72,12.7) v1(70.4,13.46) v1(70.41,12.7) v1(70.87,35.05) v1(70.87,34.29) v1(71.54,35.05) v1(71.56,34.29) v1(74.17,24.26) v1(74.17,23.5) v1(74.84,24.26) v1(74.86,23.5) v1(78.23,24.26) v1(78.23,23.5) v1(78.91,24.26) v1(78.92,23.5) v1(80.39,4.44) v1(80.39,3.68) v1(81.07,4.44) v1(81.08,3.68) v1(81.91,14.73) v1(81.91,13.97) v1(82.04,34.8) v1(82.04,34.04) v1(82.42,39.75) v1(82.42,38.99) v1(82.59,14.73) v1(82.6,13.97) v1(82.72,34.8) v1(82.73,34.04) v1(83.1,39.75) v1(83.11,38.99)
VCC: length 323.2
  Top Layer w0.254: U1.48 18.47,19.75 18.29,19.56 18.29,18.8 18.48,18.61 C2.2 ; CN1.7 27.31,32.78 v1(26.22,31.69) ; U1.1 29.84,19.75 29.53,19.44 U1.64 29.54,17.74 C4.2 ; 33.74,25.75 31.54,25.75 U1.13 ; v1(28.56,27.66) 28.56,29.22 U1.19 ; U1.32 22.03,28.38 21.78,28.13 19.62,28.13 19.37,28.38 C1.2
  Top Layer w0.508: U4.10 56.75,35.76 49.48,35.76 49.03,36.22 v1(49.03,36.58) 48.77,36.32 42.8,36.32 41.53,35.05 36.32,35.05 35.61,34.34 35.61,30.02 v1(34.29,28.7) 33.85,28.26 30.26,28.26 29.66,27.66 v1(28.56,27.66) ; v1(33.78,24.26) 33.78,25.71 33.74,25.75 ; C17.1 55.05,16.44 v1(54.99,16.38) ; R12.1 55.02,31.09 54.21,31.9 49.03,31.9 ; 49.03,31.9 R1.2 ; 49.03,31.9 v1(49.03,34.16) ; C1.2 19.37,29.85 17.38,31.83 v1(17.38,38.72) ; v1(80.01,10.92) v1(80.01,16.38) BUZ1.1 ; v1(25.65,7.75) v1(12.06,7.75) 12.06,5.08 11.68,4.7 4.95,4.7 4.57,4.32 4.57,2.29 4.32,2.03 SW3.1 ; 21.08,13.33 21.08,18.29 20.76,18.61 C2.2 ; v1(12.05,38.99) v1(12.05,24.64) ; H2.1 11.92,14.22 v1(12.05,14.1) ; v1(32.26,13.21) 32.26,15.49 31.9,15.85 C4.2
  Bottom Layer w0.254: v1(26.22,31.69) 27.5,31.69 28.19,30.99 28.19,28.02 v1(28.56,27.66)
  Bottom Layer w0.508: 12.06,14.08 12.94,13.21 v1(21.08,13.21) v1(32.26,13.21) ; 12.06,14.08 v1(12.06,7.75) ; 12.06,14.08 v1(12.05,14.1) v1(12.05,24.64) ; v1(54.99,16.38) v1(80.01,16.38) ; v1(34.29,28.7) 33.78,28.19 v1(33.78,24.26) ; v1(25.65,7.75) 25.91,7.49 78.87,7.49 80.01,8.64 v1(80.01,10.92) ; CN1.7 27.31,32.78 v1(26.22,31.69) ; v1(49.03,34.16) v1(49.03,36.58) 49.02,36.58 49.02,41.91 48.51,42.42 34.93,42.42 34.67,42.16 v1(34.67,40) ; v1(15.62,38.72) v1(17.38,38.72)
  vias: v1(10.47,38.99) v1(15.62,40.13)
BAT+: length 47.8
  Top Layer w0.762: v1(74.55,29.84) 75.56,29.84 76.2,29.21 76.2,3.56 75.06,2.41 56.48,2.41
  vias: v1(75.69,33.27)
BAT-: length 47.3
  Top Layer w0.635: Q5.1 59.54,29.06 58.8,28.32 58.8,8.51 57.15,6.86 40.26,6.86 39.28,5.88 39.28,2.41
BLK: length 13.3
  Top Layer w0.254: U1.24 26.03,27.44 26.54,26.92 29.72,26.92 30.49,27.7 36.02,27.7 R14.1
BOOT0: length 36.9
  Top Layer w0.254: U1.60 27.53,2.51 27.11,2.09 7.79,2.09 7.73,2.03 6.1,2.03
BOOT1: length 16.7
  Top Layer w0.254: v1(23.88,27.43) 24.03,27.59 U1.28 ; R3.2 v1(16.51,25.91)
  Bottom Layer w0.254: v1(23.88,27.43) 23.88,24.18 23.7,24 18.52,24 18.01,24.51 17.02,24.51 16.51,25.02 v1(16.51,25.91)
BUZ: length 54.4
  Top Layer w0.254: v1(23.5,12.32) 23.53,12.36 U1.52 ; v1(60.83,12.32) 65.15,12.32 65.91,13.08 R18.1
  Bottom Layer w0.254: v1(60.83,12.32) v1(23.5,12.32)
CS: length 40.8
  Top Layer w0.254: v1(27.05,27.56) 27.56,27.56 28.03,28.03 U1.20 ; v1(30.35,29.08) 33.02,29.08 35.05,31.11 35.05,35.43 35.38,35.76 38.94,35.76 39.75,36.58 39.75,37.21 39.95,37.41 54.18,37.41 54.61,37.85 U4.7
  Bottom Layer w0.254: v1(27.05,27.56) 27.05,27.28 27.31,27.02 29.82,27.02 30.35,27.56 v1(30.35,29.08)
D1/D2: length 2.7
  Top Layer w0.254: Q5.2 Q5.5
DP+: length 11
  Top Layer w0.254: U5.5 12.45,20.45 12.25,20.25 USB2.B6 5.65,20.25 5.4,20.5 5.4,21.09 5.56,21.25 USB2.A6
DP-: length 11.2
  Top Layer w0.254: 7.55,20.89 7.55,21.5 7.3,21.75 6.47,21.75 ; 7.55,20.89 7.42,20.75 USB2.A7 6.47,20.75 ; 7.55,20.89 7.57,20.9 7.57,23.82 7.87,24.13 10.92,24.13 11.18,23.88 U5.6
LED_K: length 17
  Top Layer w0.254: R13.2 46.3,29.16 46.86,29.72 46.86,34.54 47.37,35.05 55.01,35.05 55.01,35.05 U4.11
NRST: length 26.9
  Top Layer w0.254: U1.7 36.21,22.75 36.83,23.37 36.83,25.53 37.47,26.16 48.39,26.16 49.03,26.8 R1.1 49.03,28.83 49.15,28.96 50.8,28.96 50.98,28.78 50.98,28.44 C7.2 SW4.2
OSC32_IN: length 8.2
  Top Layer w0.254: U1.3 33.74,20.75 34.1,20.38 C19.2 34.23,17.14 X2.1
OSC32_OUT: length 11.3
  Top Layer w0.254: X2.2 37.15,17.14 C20.2 36.87,20.54 36.16,21.25 U1.4
OSC_IN: length 12.6
  Top Layer w0.254: U1.5 37.31,21.75 37.52,21.53 C5.2 41.44,21.53 X1.1
OSC_OUT: length 12.7
  Top Layer w0.254: U1.6 36.87,22.25 38.05,23.43 C6.2 42.2,23.43 X1.2
PA9: length 49.3
  Top Layer w0.254: 16.94,24.43 16.89,24.38 16.89,9.78 16.26,9.14 H2.3 ; 16.94,24.43 17.02,24.51 18.03,24.51 18.41,24.13 18.41,23.24 18.91,22.75 U1.42 ; 16.94,24.43 16.94,24.51 14.99,24.51 ; v1(14.99,33.02) 14.99,24.51 ; 14.99,24.51 U5.3
  Bottom Layer w0.254: v1(14.99,33.02) 15.77,33.81 CN1.2
PA10: length 46
  Top Layer w0.254: H2.2 14.86,11.68 15.62,12.45 15.62,19.05 16.26,19.69 U5.2 16.26,23.37 v1(15.75,23.88) ; U1.43 20.01,22.22 v1(18.41,22.22)
  Bottom Layer w0.254: v1(18.41,22.22) 18.41,23.5 18.03,23.88 v1(15.75,23.88) 15.57,24.06 15.57,32.08 15.75,32.26 17.02,32.26 17.65,31.62 21.46,31.62 22.22,32.39 CN1.4
PC13: length 57.5
  Top Layer w0.254: v1(24.64,26.92) 24.64,20.83 25.18,20.29 31.49,20.29 U1.2 ; 1.03,41.39 1.16,41.52 1.16,43.7 1.91,44.45 16.51,44.45 16.74,44.22 16.74,31.73 v1(16.38,31.36)
  Bottom Layer w0.254: v1(16.38,31.36) 16.63,31.11 24.76,31.11 25.02,30.86 25.02,27.31 v1(24.64,26.92)
RES: length 45.8
  Top Layer w0.254: v1(30.99,29.97) 32.89,29.97 34.54,31.62 34.54,35.94 34.8,36.19 38.74,36.19 39.19,36.65 39.19,37.67 39.37,37.85 53.85,37.85 54.55,38.55 U4.6 ; v1(25.53,25.4) 25.53,29.24 U1.25
  Bottom Layer w0.254: v1(30.99,29.97) 30.99,26.29 30.1,25.4 v1(25.53,25.4)
RS: length 35.3
  Top Layer w0.254: U1.17 29.53,30.17 30.25,30.89 33.05,30.89 33.78,31.62 33.78,36.45 34.16,36.83 37.85,36.83 38.23,37.21 38.23,38.1 38.61,38.48 53.21,38.48 53.97,39.24 55.01,39.24 55.01,39.25 U4.5
SCL: length 38.6
  Top Layer w0.254: U4.4 53.41,39.95 52.44,38.98 R30.1 37.21,37.72 36.96,37.47 33.53,37.47 33.15,37.08 33.15,31.62 32.84,31.32 27.89,31.32 27.53,30.96 U1.21
SDA: length 44.4
  Top Layer w0.254: U4.3 37.32,40.65 R29.1 37.2,42.05 36.58,42.67 33.15,42.67 32.64,42.16 32.64,32.13 32.26,31.75 27.18,31.75 26.53,31.1 U1.23
SWCLK: length 17
  Top Layer w0.254: CN1.1 19.81,33.68 v1(19.81,30.48) ; v1(21.54,26.59) 21.78,26.36 21.78,19.25 22.03,19 U1.49
  Bottom Layer w0.254: v1(19.81,30.48) 19.81,28.32 v1(21.54,26.59)
SWDIO: length 17
  Top Layer w0.254: v1(22.48,26.54) 22.53,26.49 U1.50 ; CN1.3 22.22,32.26 21.26,31.29 v1(21.26,30.48)
  Bottom Layer w0.254: v1(22.48,26.54) 22.22,26.8 22.22,26.81 21.26,27.77 v1(21.26,30.48)
$1N3244: length 1.5
  Top Layer w0.254: 2.54,41.39 2.54,41.4 4.02,41.4
$1N3260: length 1.7
  Top Layer w0.254: R5.1 4.09,39.25 LED2.1
$1N3280: length 3.7
  Top Layer w0.254: R9.2 68.02,26.27 67.94,26.35 67.94,27.94 67.76,28.13 Q1.2
$1N3281: length 3.6
  Top Layer w0.254: Q1.5 70.23,28.13 70.25,28.11 R10.1
$1N3299: length 10.5
  Top Layer w0.254: 56.77,34.2 56.91,34.35 59.25,34.35 59.56,34.04 59.56,29.97 58.67,29.08 R12.2
$1N3320: length 1.6
  Top Layer w0.254: R13.1 43.54,29.18 Q4.3
$1N3321: length 3.2
  Top Layer w0.254: 38.23,30.16 R15.2 ; 38.23,30.16 38.26,30.13 Q4.1 ; 38.23,30.16 R14.2
$1N3342: length 2.7
  Top Layer w0.254: U5.4 C18.2
$1N3364: length 1.9
  Top Layer w0.254: U11.2 79.14,39.41 R26.2
$1N3367: length 2.9
  Top Layer w0.254: 79.27,30.72 79.13,30.85 U11.7
$1N3368: length 1.7
  Top Layer w0.254: R27.2 82.37,30.72 LED6.1
$1N3369: length 1.6
  Top Layer w0.254: R28.2 82.37,28.7 LED7.1
$1N3370: length 6.2
  Top Layer w0.254: R28.1 79.27,28.7 78.1,28.7 77.86,28.94 U11.6
$1N3387: length 2.1
  Top Layer w0.254: Q1.1 66.72,29.06 Q5.6
$1N3388: length 2.1
  Top Layer w0.254: Q5.4 66.72,27.16 Q1.3
$1N22505: length 3.3
  Top Layer w0.254: Q6.2 66.81,20.63 66.73,20.7 65.79,20.7
$1N22563: length 2.9
  Top Layer w0.254: BUZ1.2 74,21.58 Q6.3

## Copper pours and planes (outline as drawn; the poured copper is in the pictures)
+5V on Top Layer: 6.56,36.65 6.56,37.29 6.73,37.47 10.41,37.47 10.8,37.08 10.8,33.91 10.54,33.66 6.44,33.66 6.06,34.04 4.95,34.04 4.83,34.16 4.83,34.8 4.95,34.92 6.35,34.92 6.6,35.18 6.6,36.6
+5V on Top Layer: 71.25,39.37 71.25,40.51 71.88,41.15 76.71,41.15 77.22,40.64 77.22,38.78 76.98,38.55 72.07,38.55
GND on Top Layer: -2.16,47.75 84.58,47.75 84.58,-5.97 -2.16,-5.97
GND on Bottom Layer: -3.17,49.78 87.12,49.78 87.12,-8.64 -3.17,-8.64
VCC on Top Layer: 34.16,41.28 34.67,41.78 36.15,41.78 36.45,41.49 36.45,38.48 36.07,38.1 34.67,38.1 34.16,38.61
VCC on Top Layer: 4.77,41.87 5.06,42.16 6.23,42.16 6.48,41.91 6.48,40.39 6.86,40 11.95,40 12.49,40.55 12.49,43.74 12.95,44.2 14,44.2 14.36,43.83 14.36,41.23 14.58,41.01 16.02,41.01 16.21,40.81 16.21,37.04 15.75,36.58 12.83,36.58 11.3,38.1 5.24,38.1 4.77,38.57
VCC on Top Layer: 53.82,28.42 53.97,28.57 53.97,29.84 54.23,30.1 55.5,30.1 55.63,29.97 55.63,26.42 55.37,26.16 54.61,26.16 53.82,26.95
BAT+ on Top Layer: 73.97,33.64 73.97,34.06 74.26,34.35 77.03,34.35 77.09,34.29 77.09,32.77 76.84,32.51 76.03,32.51 75.66,32.14 75.66,27.65 75.18,27.18 74.19,27.18 73.79,27.58 73.79,33.46
